# EAGLE schematic Bat2 (EAGLE 7.2.0)
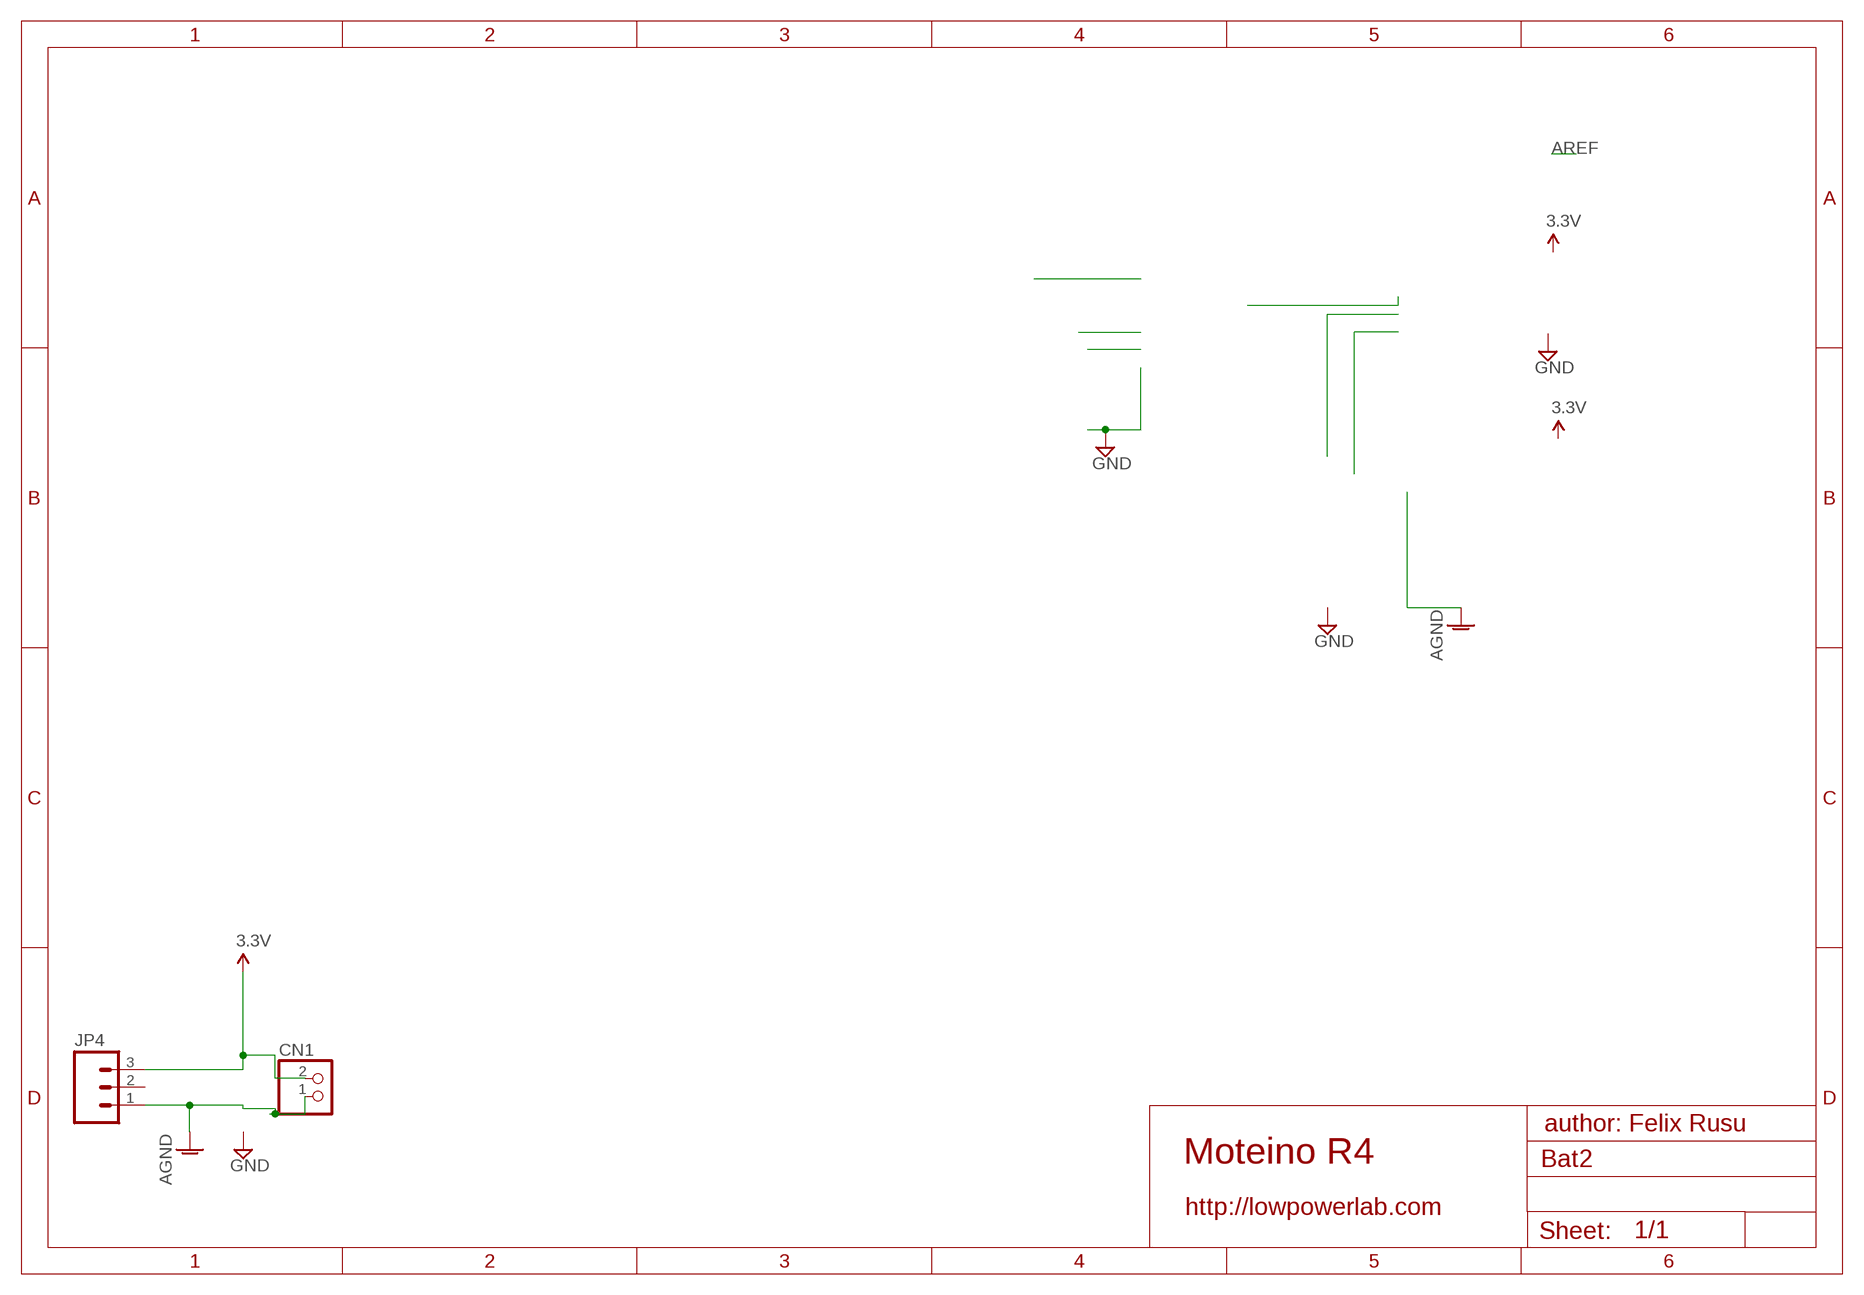
[diagram p0: schematic, sheet 1]

## Parts
CN1  JST_2PIN-SMT  [JST-PH-2-SMT]
JP4  M03PTH  [1X03]

## Nets
AGND [power]: CN1.1 JP4.1
VCC: CN1.2 JP4.3 ; supply symbol labelled 3.3V
Unconnected: JP4.2

## Notes on the sheet
- author: Felix Rusu
- Moteino R4
- http://lowpowerlab.com

## Library data of the parts
CN1 = adafruit:JST_2PIN: JST 2-Pin Connectors of various flavors SMT-RA (S2B-PH-SM4) 4UConnector #17311 SMT (B2B-PH-SM4) THM-RA (S2B-PH) THM (B2B-PH)
JP4 = SparkFun-Connectors:M03: Header 3 Standard 3-pin 0.1" header. Use with straight break away headers (SKU : PRT-00116), right angle break away headers (PRT-00553), swiss pins (PRT-00743), machine pins (PRT-00117), and female headers (PRT-00115). Molex polarized connector foot print use with SKU : PRT-08232 with associated crimp pins and housings.

## Net classes
1 power: width 0.381 mm, clearance 0.254 mm